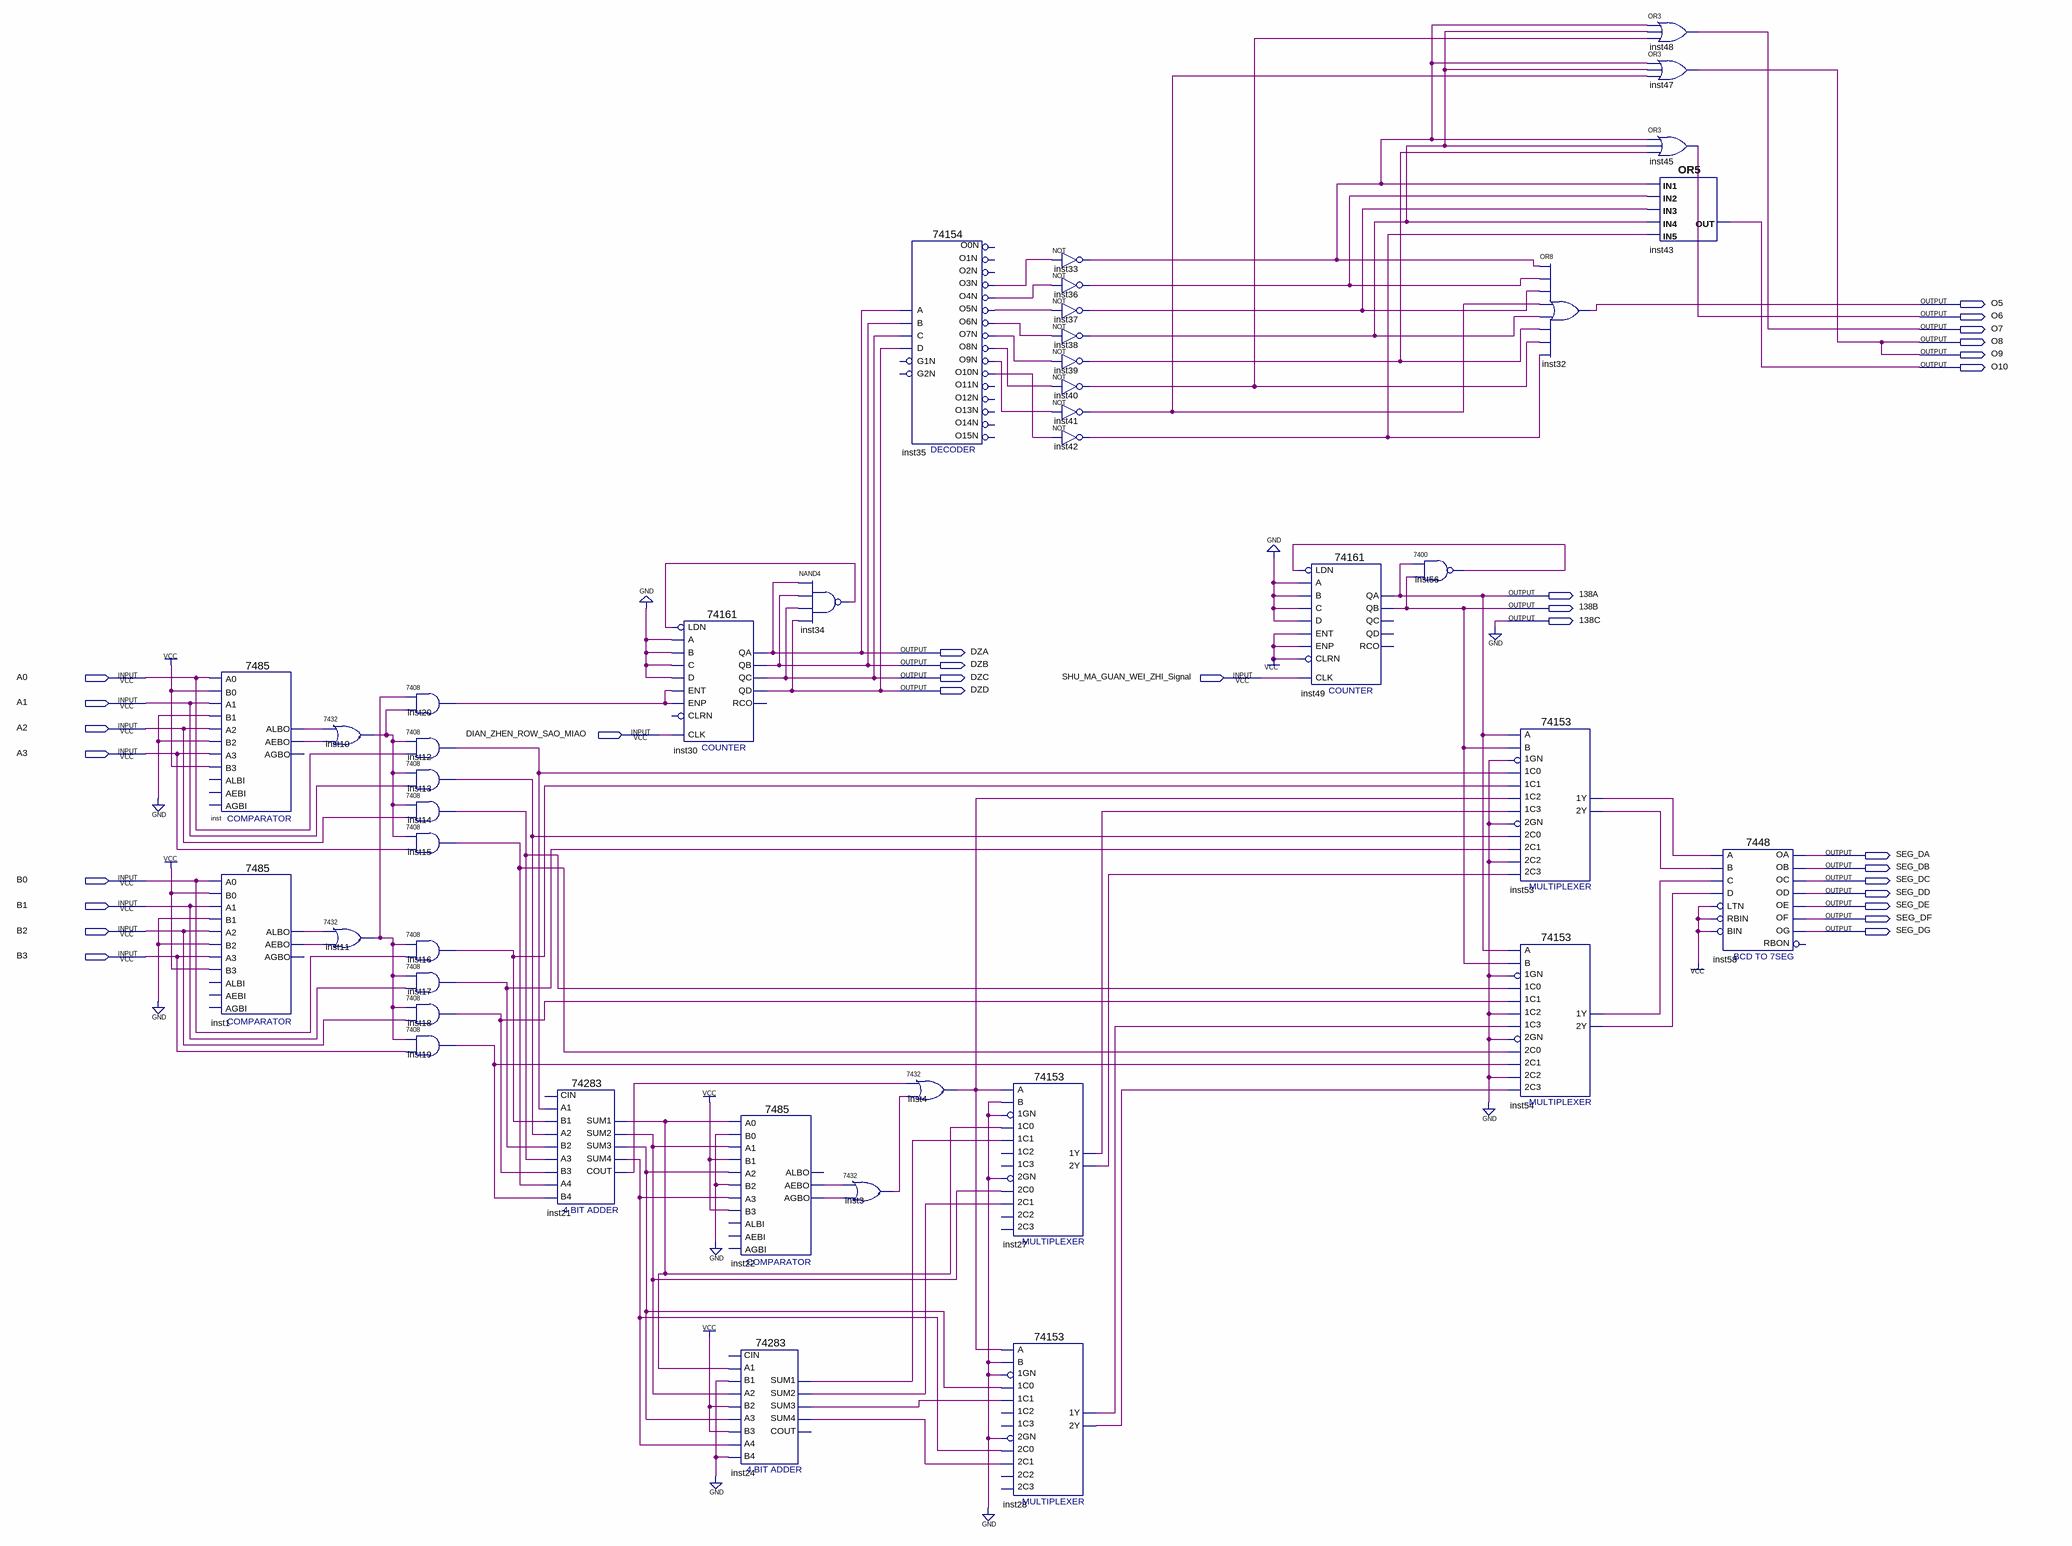
[diagram p0: schematic sheet]
// Quartus schematic EDA.bdf as structural Verilog: 41 symbols, 30 pins
module EDA (
  input  A0,
  input  SHU_MA_GUAN_WEI_ZHI_Signal,
  input  A1,
  input  A2,
  input  DIAN_ZHEN_ROW_SAO_MIAO,
  input  A3,
  input  B0,
  input  B1,
  input  B2,
  input  B3,
  output O5,
  output O6,
  output O7,
  output O8,
  output O9,
  output O10,
  output \138A ,
  output \138B ,
  output \138C ,
  output DZA,
  output DZB,
  output DZC,
  output DZD,
  output SEG_DA,
  output SEG_DB,
  output SEG_DC,
  output SEG_DD,
  output SEG_DE,
  output SEG_DF,
  output SEG_DG
);

  wire inst1_aebo, inst1_albo, inst3_1, inst4_1, inst10_1, inst11_1, inst12_1, inst13_1, inst14_1, inst15_1,
       inst16_1, inst17_1, inst18_1, inst19_1, inst20_1, inst21_cout, inst21_sum1, inst21_sum2, inst21_sum3,
       inst21_sum4, inst22_aebo, inst22_agbo, inst24_sum1, inst24_sum2, inst24_sum3, inst24_sum4, inst27_1y,
       inst27_2y, inst28_1y, inst28_2y, inst33_out, inst34_out, inst35_o3n, inst35_o4n, inst35_o5n,
       inst35_o6n, inst35_o7n, inst35_o8n, inst35_o9n, inst35_o10n, inst36_out, inst37_out, inst38_out,
       inst39_out, inst40_out, inst41_out, inst42_out, inst53_1y, inst53_2y, inst54_1y, inst54_2y, inst56_1,
       inst_aebo, inst_albo;

  \7485  inst (
    .A3(A3), .B2(1'b0), .A2(A2), .A0(A0), .B0(1'b1), .B3(1'b1), .A1(A1), .B1(1'b0), .ALBO(inst_albo),
    .AEBO(inst_aebo));  // open: AEBI, AGBI, ALBI, AGBO
  \7485  inst1 (
    .A3(B3), .B2(1'b0), .A2(B2), .A0(B0), .B0(1'b1), .B3(1'b1), .A1(B1), .B1(1'b0), .ALBO(inst1_albo),
    .AEBO(inst1_aebo));  // open: AEBI, AGBI, ALBI, AGBO
  \7432  inst10 (.\2 (inst_albo), .\3 (inst_aebo), .\1 (inst10_1));
  \7432  inst11 (.\2 (inst1_albo), .\3 (inst1_aebo), .\1 (inst11_1));
  \7408  inst20 (.\3 (inst10_1), .\2 (inst11_1), .\1 (inst20_1));
  \7408  inst12 (.\3 (A0), .\2 (inst10_1), .\1 (inst12_1));
  \7408  inst13 (.\3 (A1), .\2 (inst10_1), .\1 (inst13_1));
  \7408  inst14 (.\3 (A2), .\2 (inst10_1), .\1 (inst14_1));
  \7408  inst15 (.\3 (A3), .\2 (inst10_1), .\1 (inst15_1));
  \7408  inst16 (.\3 (B0), .\2 (inst11_1), .\1 (inst16_1));
  \7408  inst17 (.\3 (B1), .\2 (inst11_1), .\1 (inst17_1));
  \7408  inst18 (.\3 (B2), .\2 (inst11_1), .\1 (inst18_1));
  \7408  inst19 (.\3 (B3), .\2 (inst11_1), .\1 (inst19_1));
  \74283  inst21 (
    .A1(inst12_1), .A2(inst13_1), .B2(inst17_1), .A3(inst14_1), .A4(inst15_1), .B4(inst19_1), .B1(inst16_1),
    .B3(inst18_1), .SUM4(inst21_sum4), .COUT(inst21_cout), .SUM1(inst21_sum1), .SUM2(inst21_sum2),
    .SUM3(inst21_sum3));  // open: CIN
  \74161  inst30 (
    .CLK(DIAN_ZHEN_ROW_SAO_MIAO), .ENP(inst20_1), .LDN(inst34_out), .A(1'b0), .D(1'b0), .ENT(inst20_1),
    .B(1'b0), .C(1'b0), .QD(DZD), .QC(DZC), .QB(DZB), .QA(DZA));  // open: CLRN, RCO
  \7485  inst22 (
    .A3(inst21_sum4), .B2(1'b0), .A2(inst21_sum3), .A0(inst21_sum1), .B0(1'b0), .B3(1'b1), .A1(inst21_sum2),
    .B1(1'b1), .AGBO(inst22_agbo), .AEBO(inst22_aebo));  // open: AEBI, AGBI, ALBI, ALBO
  \74283  inst24 (
    .A1(inst21_sum1), .A2(inst21_sum2), .B2(1'b1), .A3(inst21_sum3), .A4(inst21_sum4), .B4(1'b0), .B1(1'b0),
    .B3(1'b1), .SUM4(inst24_sum4), .SUM1(inst24_sum1), .SUM2(inst24_sum2), .SUM3(inst24_sum3));  // open: CIN, COUT
  nand inst34 (inst34_out, DZA, DZB, DZC, DZD);
  \7432  inst3 (.\2 (inst22_aebo), .\3 (inst22_agbo), .\1 (inst3_1));
  \74154  inst35 (
    .C(DZC), .D(DZD), .B(DZB), .A(DZA), .O10N(inst35_o10n), .O4N(inst35_o4n), .O3N(inst35_o3n),
    .O7N(inst35_o7n), .O6N(inst35_o6n), .O5N(inst35_o5n), .O9N(inst35_o9n), .O8N(inst35_o8n));  // open: G1N, G2N, O0N, O12N, O15N, O11N, O1N, O13N, O14N, O2N
  \7432  inst4 (.\2 (inst21_cout), .\3 (inst3_1), .\1 (inst4_1));
  \74153  inst27 (
    .\1C1 (inst24_sum1), .\1GN (1'b0), .\1C0 (inst21_sum1), .\2C0 (inst21_sum2), .\2GN (1'b0), .B(1'b0),
    .A(inst4_1), .\2C1 (inst24_sum2), .\1Y (inst27_1y), .\2Y (inst27_2y));  // open: 2C2, 1C2, 1C3, 2C3
  \74153  inst28 (
    .\1C1 (inst24_sum3), .\1GN (1'b0), .\1C0 (inst21_sum3), .\2C0 (inst21_sum4), .\2GN (1'b0), .B(1'b0),
    .A(inst4_1), .\2C1 (inst24_sum4), .\1Y (inst28_1y), .\2Y (inst28_2y));  // open: 2C2, 1C2, 1C3, 2C3
  not inst33 (inst33_out, inst35_o3n);
  not inst36 (inst36_out, inst35_o4n);
  not inst37 (inst37_out, inst35_o5n);
  not inst38 (inst38_out, inst35_o6n);
  not inst39 (inst39_out, inst35_o7n);
  not inst40 (inst40_out, inst35_o8n);
  not inst41 (inst41_out, inst35_o9n);
  not inst42 (inst42_out, inst35_o10n);
  \74161  inst49 (
    .CLRN(1'b1), .CLK(SHU_MA_GUAN_WEI_ZHI_Signal), .ENP(1'b1), .LDN(inst56_1), .A(1'b0), .D(1'b0),
    .ENT(1'b1), .B(1'b0), .C(1'b0), .QB(\138B ), .QA(\138A ));  // open: QD, QC, RCO
  \7400  inst56 (.\3 (\138B ), .\2 (\138A ), .\1 (inst56_1));
  \74153  inst53 (
    .\1C1 (inst16_1), .\1GN (1'b0), .\1C0 (inst12_1), .\2C0 (inst13_1), .\2GN (1'b0), .\2C2 (1'b0),
    .\1C2 (inst4_1), .\1C3 (inst27_1y), .B(\138B ), .A(\138A ), .\2C1 (inst17_1), .\2C3 (inst27_2y),
    .\1Y (inst53_1y), .\2Y (inst53_2y));
  \74153  inst54 (
    .\1C1 (inst18_1), .\1GN (1'b0), .\1C0 (inst14_1), .\2C0 (inst15_1), .\2GN (1'b0), .\2C2 (1'b0),
    .\1C2 (1'b0), .\1C3 (inst28_1y), .B(\138B ), .A(\138A ), .\2C1 (inst19_1), .\2C3 (inst28_2y),
    .\1Y (inst54_1y), .\2Y (inst54_2y));
  or inst32 (O5, inst33_out, inst36_out, inst37_out, inst41_out, inst38_out, inst39_out, inst40_out, inst42_out);
  or inst48 (O7, inst33_out, inst38_out, inst40_out);
  or inst47 (O8, inst33_out, inst38_out, inst41_out);
  or inst45 (O6, inst33_out, inst38_out, inst39_out);
  or inst43 (O10, inst33_out, inst36_out, inst37_out, inst38_out, inst42_out);
  \7448  inst58 (
    .A(inst53_1y), .C(inst54_1y), .D(inst54_2y), .B(inst53_2y), .RBIN(1'b1), .BIN(1'b1), .LTN(1'b1),
    .OC(SEG_DC), .OE(SEG_DE), .OD(SEG_DD), .OF(SEG_DF), .OG(SEG_DG), .OB(SEG_DB), .OA(SEG_DA));  // open: RBON

  assign \138C  = 1'b0;
  assign O9 = O8;
endmodule
